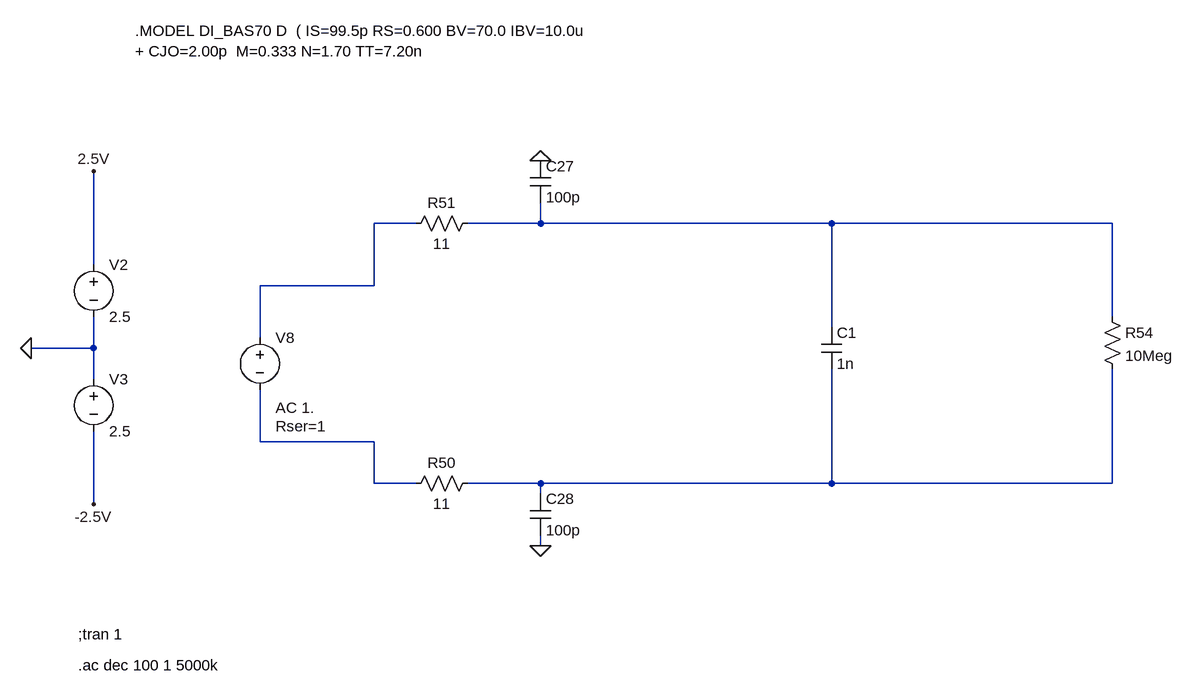
[diagram p0: schematic anti_aliasing_filter.asc]
anti_aliasing_filter.asc, the LTspice schematic file:
Version 4
SHEET 1 4816 5224
WIRE 368 -64 304 -64
WIRE 560 -64 560 -96
WIRE 560 -64 448 -64
WIRE 1008 -64 560 -64
WIRE 1440 -64 1008 -64
WIRE -128 0 -128 -144
WIRE 304 32 304 -64
WIRE 304 32 128 32
WIRE 1440 80 1440 -64
WIRE 1008 96 1008 -64
WIRE 128 112 128 32
WIRE -128 128 -128 80
WIRE -128 128 -224 128
WIRE -128 176 -128 128
WIRE 128 272 128 192
WIRE 304 272 128 272
WIRE 304 336 304 272
WIRE 368 336 304 336
WIRE 560 336 448 336
WIRE 1008 336 1008 160
WIRE 1008 336 560 336
WIRE 1440 336 1440 160
WIRE 1440 336 1008 336
WIRE 560 352 560 336
WIRE -128 368 -128 256
WIRE 560 432 560 416
FLAG -224 128 0
FLAG -128 -144 2.5V
FLAG -128 368 -2.5V
FLAG 560 -160 0
FLAG 560 432 0
SYMBOL voltage -128 -16 R0
WINDOW 123 0 0 Left 2
WINDOW 39 0 0 Left 2
SYMATTR InstName V2
SYMATTR Value 2.5
SYMBOL voltage -128 160 R0
WINDOW 123 0 0 Left 2
WINDOW 39 0 0 Left 2
SYMATTR InstName V3
SYMATTR Value 2.5
SYMBOL voltage 128 96 R0
WINDOW 123 24 124 Left 2
WINDOW 39 24 152 Left 2
SYMATTR Value2 AC 1.
SYMATTR SpiceLine Rser=1
SYMATTR InstName V8
SYMATTR Value ""
SYMBOL cap 544 -160 R0
SYMATTR InstName C27
SYMATTR Value 100p
SYMBOL cap 544 352 R0
SYMATTR InstName C28
SYMATTR Value 100p
SYMBOL res 464 320 R90
WINDOW 0 0 56 VBottom 2
WINDOW 3 32 56 VTop 2
SYMATTR InstName R50
SYMATTR Value 11
SYMBOL res 464 -80 R90
WINDOW 0 0 56 VBottom 2
WINDOW 3 32 56 VTop 2
SYMATTR InstName R51
SYMATTR Value 11
SYMBOL res 1424 64 R0
SYMATTR InstName R54
SYMATTR Value 10Meg
SYMBOL cap 992 96 R0
SYMATTR InstName C1
SYMATTR Value 1n
TEXT -64 -360 Left 2 !.MODEL DI_BAS70 D  ( IS=99.5p RS=0.600 BV=70.0 IBV=10.0u\n+ CJO=2.00p  M=0.333 N=1.70 TT=7.20n
TEXT -152 568 Left 2 !;tran 1
TEXT -152 616 Left 2 !.ac dec 100 1 5000k

The netlist it stands for:
* anti_aliasing_filter.asc
V2 2.5V 0 2.5
V3 0 -2.5V 2.5
V8 N001 N003 AC 1. Rser=1
C27 0 N002 100p
C28 N004 0 100p
R50 N004 N003 11
R51 N002 N001 11
R54 N002 N004 10Meg
C1 N002 N004 1n
.MODEL DI_BAS70 D  ( IS=99.5p RS=0.600 BV=70.0 IBV=10.0u
+ CJO=2.00p  M=0.333 N=1.70 TT=7.20n
;tran 1
.ac dec 100 1 5000k
.backanno
.end